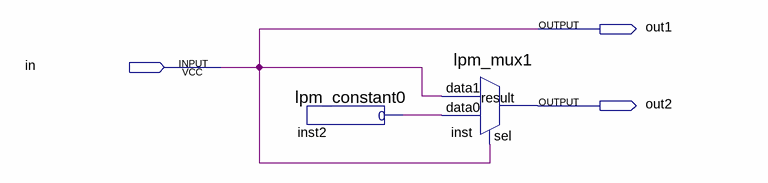
[diagram p0: schematic sheet]
// Quartus schematic 1to2.bdf as structural Verilog: 2 symbols, 3 pins
module \1to2  (
  input  in,
  output out1,
  output out2
);

  wire inst2_result;

  lpm_constant0 inst2 (.result(inst2_result));
  lpm_mux1 inst (.data1(in), .data0(inst2_result), .sel(in), .result(out2));

  assign out1 = in;
endmodule
